# Altium schematic sheet LED+KEY.SchDoc
size A4; SheetNumber: 2; SheetTotal: 17
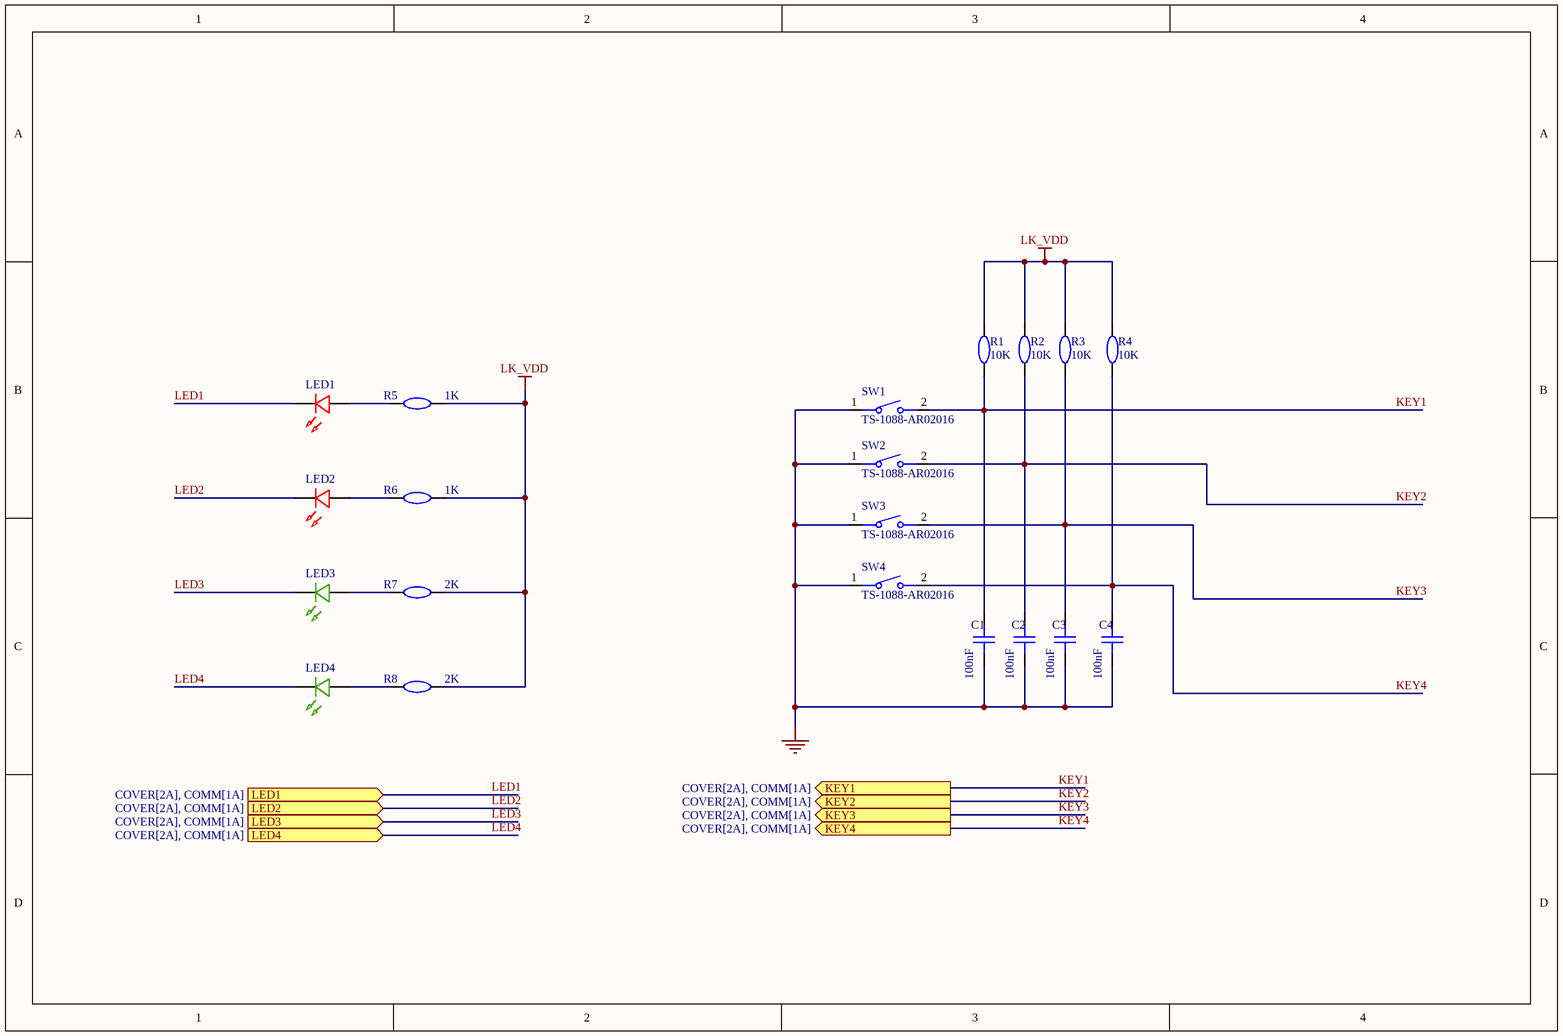
[diagram p0: LED+KEY.SchDoc]

## Parts
C1  100nF  [C0402]
C2  100nF  [C0402]
C3  100nF  [C0402]
C4  100nF  [C0402]
LED1  LED_0603-R  [LED_0603]  (value not drawn)
LED2  LED_0603-R  [LED_0603]  (value not drawn)
LED3  LED_0603-R  [LED_0603]  (value not drawn)
LED4  LED_0603-R  [LED_0603]  (value not drawn)
R1  10K  [R0402]
R2  10K  [R0402]
R3  10K  [R0402]
R4  10K  [R0402]
R5  1K  [R0402]
R6  1K  [R0402]
R7  2K  [R0402]
R8  2K  [R0402]
SW1  TS-1088-AR02016  [SW-SMD_L3.9-W3.0-P4.45]
SW2  TS-1088-AR02016  [SW-SMD_L3.9-W3.0-P4.45]
SW3  TS-1088-AR02016  [SW-SMD_L3.9-W3.0-P4.45]
SW4  TS-1088-AR02016  [SW-SMD_L3.9-W3.0-P4.45]

## Ports
KEY1 (out, see COVER[2A], COMM[1A]), KEY2 (out, see COVER[2A], COMM[1A]), KEY3 (out, see COVER[2A], COMM[1A]), KEY4 (out, see COVER[2A], COMM[1A]), LED1 (in, see COVER[2A], COMM[1A]), LED2 (in, see COVER[2A], COMM[1A]), LED3 (in, see COVER[2A], COMM[1A]), LED4 (in, see COVER[2A], COMM[1A])

## Nets
GND: C1.1 C2.1 C3.1 C4.1 SW1.1 SW2.1 SW3.1 SW4.1
LK_VDD: R1.2 R2.2 R3.2 R4.2 R5.1 R6.1 R7.1 R8.1
KEY1: C1.2 R1.1 SW1.2 ; port KEY1
KEY2: C2.2 R2.1 SW2.2 ; port KEY2
KEY3: C3.2 R3.1 SW3.2 ; port KEY3
KEY4: C4.2 R4.1 SW4.2 ; port KEY4
LED1: LED1.1(C) ; port LED1
LED2: LED2.1(C) ; port LED2
LED3: LED3.1(C) ; port LED3
LED4: LED4.1(C) ; port LED4
NetLED1_2: LED1.2(A) R5.2
NetLED2_2: LED2.2(A) R6.2
NetLED3_2: LED3.2(A) R7.2
NetLED4_2: LED4.2(A) R8.2

## Library data of the parts
C1-C4 = CAP_0402: Symbol: CapAcitance; Device: CAP_0603; Convert to PCB: yes; Add into BOM: yes; Supplier Footprint: 0603; Value: 100nF; Name: 100nF
LED1 LED2 = LED_0603-R: Symbol: LED_R; Convert to PCB: yes; Device: LED_0603-R; Add into BOM: yes; Supplier Footprint: 0603
LED3 LED4 = LED_0603-G: Symbol: LED_R; Convert to PCB: yes; Device: LED_0603-R; Add into BOM: yes; Supplier Footprint: 0603
R1-R8 = Res_0402: Symbol: 电阻; Device: Res_0603; Convert to PCB: yes; Add into BOM: yes; Supplier Footprint: 0603
  R1-R4: Value: 10K; Name: 10K
  R5 R6: Value: 1K; Name: 1K
  R7 R8: Value: 2K; Name: 2K
SW1-SW4 = TS-1088-AR02016: Manufacturer: XUNPU(讯普); Add into BOM: yes; Circuit: 单刀单掷; Actuator Style: 圆形按钮; Operating Force: 160gf; Switch Length: 4mm; Switch Width: 3mm; Switch Height: 2mm; Strike Gundam: 不带; Contact Current: 50mA; Voltage Rating (DC): 12V; Insulation Resistance: 100MΩ; Actuator/Cap Color: 黑色; Pin Style: SMD接片; Mechanical Life: 10万次; Symbol: TS-1088-AR02016; Device: TS-1088-AR02016; LCSC Part Name: 4*3*2mm 立贴 轻触开关; Supplier Part: C720477; Manufacturer Part: TS-1088-AR02016; Supplier Footprint: SMD; Datasheet: https://atta.szlcsc.com/upload/public/pdf/source/20200810/C720475_60D09DD6C54279ADDB2DC25100F1CC11.pdf; Supplier: LCSC; Convert to PCB: yes; Mounting Style: 立贴; Operating Temperature: -30℃~+80℃; Name: TS-1088-AR02016